# EAGLE design SonoffIR (EAGLE 7.7.0)
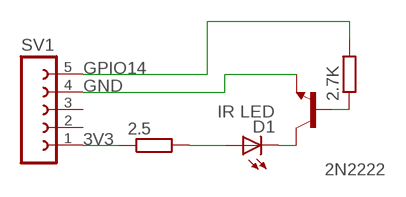
[diagram p0: schematic, sheet 1]

## Parts
2.5  R-EU_0204/2V  [0204V]
2.7K  R-EU_0204/2V  [0204V]
2N2222  2N3565  [TO92]
D1  IR LED  SFH482  [SFH482]
SV1  FE05-1  [FE05-1]

## Nets
3V3: 2.5.1 SV1.1
GND: 2N2222.3(E) SV1.4
GPIO14: 2.7K.2 SV1.5
N$1: 2.5.2 D1.A
N$2: 2.7K.1 2N2222.2(B)
N$3: 2N2222.1(C) D1.K(C)
Unconnected: SV1.2 SV1.3

## Library data of the parts
2.5 2.7K = resistor:R-EU_: RESISTOR, European symbol
2N2222 = transistor-npn:2N3565: NPN Transistor
D1 = led:SFH482: IR LED infrared emitting diode, Infineon
SV1 = con-lsta:FE05-1: FEMALE HEADER; OC_FARNELL: unknown; OC_NEWARK: unknown

## Board
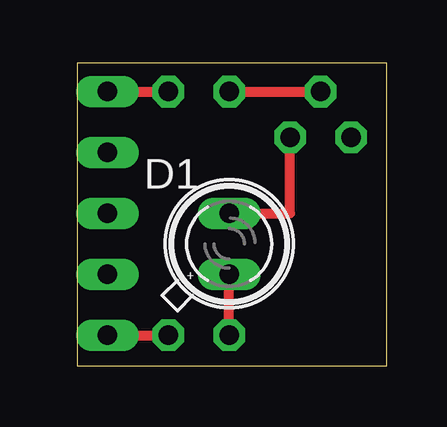
[diagram p1: board, top side]
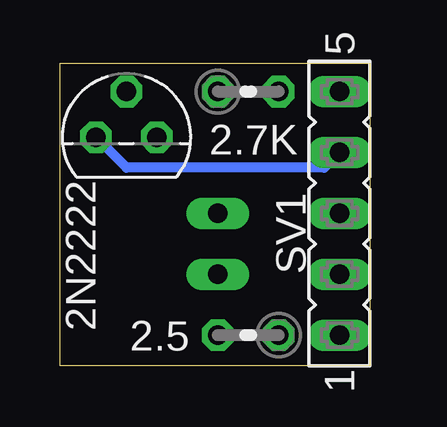
[diagram p2: board, bottom side, seen from below]

Size 12.93 x 12.62 mm. Coordinates in mm from the lower left corner, seen from the top.
Outline: 0,0 12.93,0 12.93,12.62 0,12.62 0,0
Copper layers (1*16): Top 0.035mm / dielectric 1.5mm / Bottom 0.035mm
Design rules "default": minimum track width 10mil, minimum drill 24mil, track to track 8mil, track to pad 8mil, pad to pad 8mil, via to via 8mil, smd to smd 8mil, copper to edge 40mil, drill to drill 8mil, minimum pad ring 10mil, minimum via ring 8mil, stop-mask expansion 4mil, vias tented up to drill 0mil, thermal gap 10mil

### Footprints (pad centres in the part's own frame; a part is rotated, then mirrored left to right if it is on the bottom)
0204V = drill 0.813 octagon: 1 -1.27,0; 2 1.27,0
TO92 = drill 0.813 octagon: 1 1.27,0; 2 0,1.905; 3 -1.27,0
SFH482 = drill 0.813 long: A -1.27,0; K 1.27,0
FE05-1 = drill 0.813 long: 1 -5.08,0; 2 -2.54,0; 3 0,0; 4 2.54,0; 5 5.08,0

### Placement (x,y rotation side)
2.5  5.08,1.27 180 bottom
2.7K  5.08,11.43 0 bottom
2N2222  10.16,9.53 0 bottom
D1  6.35,5.08 90 top
SV1  1.27,6.35 90 bottom

### Tracks (layer width: path | path; a pad name or v marks a point on that pad's centre or on a via)
3V3
  Top 0.406: SV1.1 2.5.1
GND
  Bottom 0.406: SV1.4 1.91,8.26 10.16,8.26 2N2222.3
GPIO14
  Top 0.406: SV1.5 2.7K.2
N$1
  Top 0.406: 2.5.2 D1.A
N$2
  Top 0.406: 2.7K.1 2N2222.2
N$3
  Top 0.406: D1.K 8.89,6.35 2N2222.1

### Text on the board
tNames: +